# EAGLE schematic Dot (EAGLE 7.7.0)

## Sheet 1 of 3
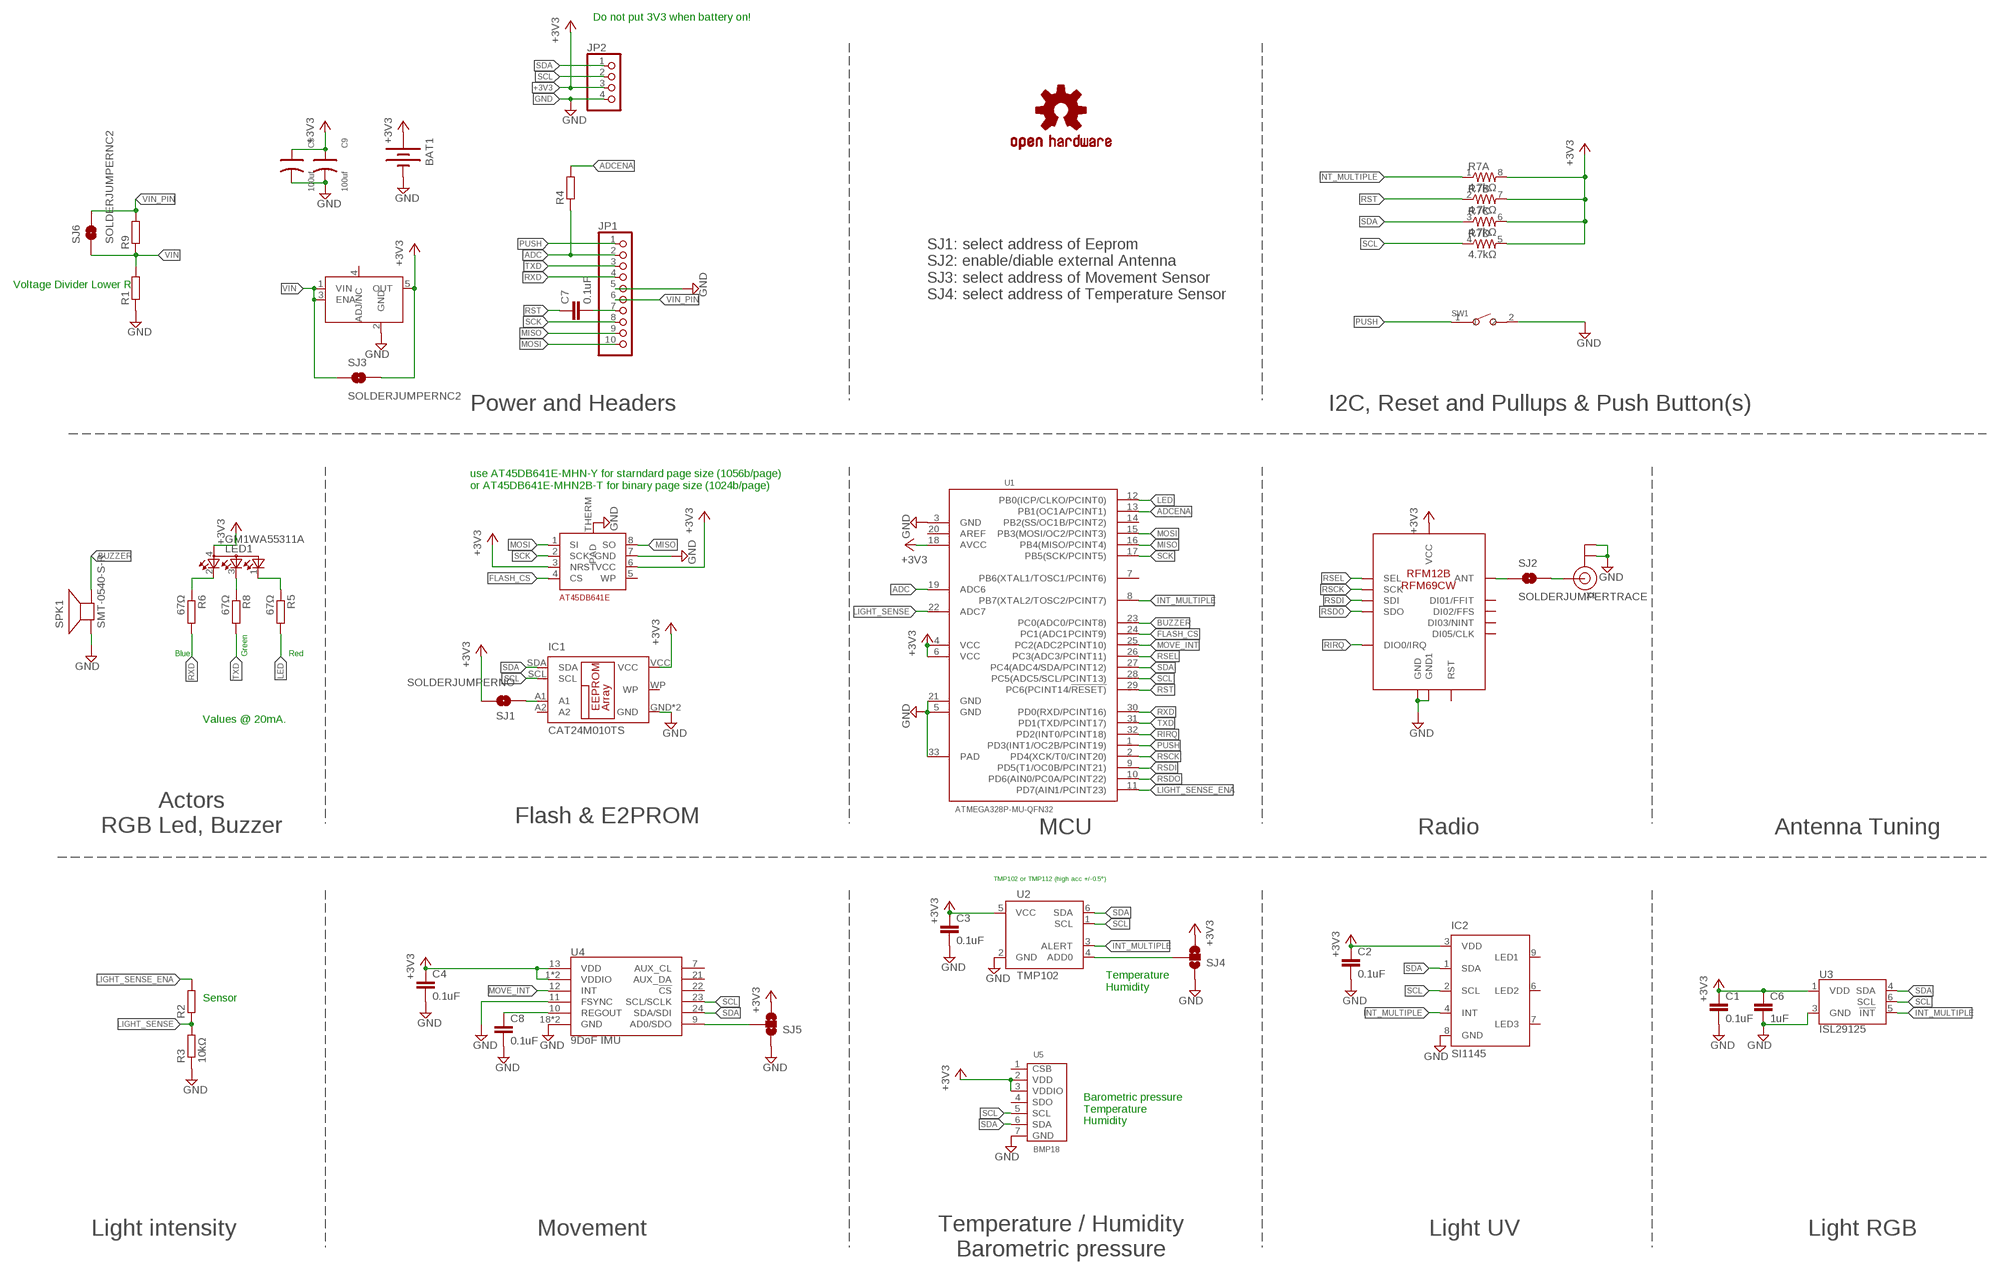
[diagram p0: schematic, sheet 1]

### Parts
BAT1  BATTERY20PTH  [BATTCOM_20MM_PTH]
C1  0.1uF  C-EUC0603  [C0603]
C2  0.1uF  C-EUC0603  [C0603]
C3  0.1uF  C-EUC0603  [C0603]
C4  0.1uF  C-EUC0603  [C0603]
C5  100uf  TANTALUM-SMD-100UF-6.3V(AVX-A)  [AVX-A]
C6  1uF  C-EUC0603  [C0603]
C7  0.1uF  C-EUC0603  [C0603]
C8  0.1uF  C-EUC0603  [C0603]
C9  100uf  TANTALUM-SMD-100UF-6.3V(AVX-A)  [AVX-A]
IC1  CAT24M010TS  [TSSOP8]
IC2  SI1145  [QFN-10]
JP1  PINHD-1X10  [1X10]
JP2  PINHD-1X4  [1X04]
LED1  GM1WA55311A  [GM1WA55311A]
LOGO1  OSHW-LOGOS  [OSHW-LOGO-S]
R1  R-EU_R0603  [R0603]
R2  R-EU_R0805  [R0805]
R3  10kΩ  R-EU_R0603  [R0603]
R4  R-EU_R0603  [R0603]
R5  67Ω  R-EU_R0603  [R0603]
R6  67Ω  R-EU_R0603  [R0603]
R7  4.7kΩ  RESISTOR-ARRAY0603-ARV  [0603-ARV]
R8  67Ω  R-EU_R0603  [R0603]
R9  R-EU_R0603  [R0603]
SJ1  SOLDERJUMPERNO  [SJ_2S-NO]
SJ2  SOLDERJUMPERTRACE  [SJ_2S-TRACE]
SJ3  SOLDERJUMPERNC2  [SJ_2S-NOTRACE]
SJ4  SOLDERJUMPER_2WAYS  [SJ_3]
SJ5  SOLDERJUMPER_2WAYS  [SJ_3]
SJ6  SOLDERJUMPERNC2  [SJ_2S-NOTRACE]
SPK1  SMT-0540-S-R  [SMT-0540-S-R]
SW1  SMD-BUTTON(2P-6.0X3.0X2.5MM)-DHT-1163S  [SW2-4.0-6.0X3.0X2.5MM]
U1  ATMEGA328P-MU-QFN32  MCU-ATMEGA328P-MU(QFN32)  [QFN32G-0.5-5X5MM]
U2  TMP102  [SOT563]
U3  ISL29125  [ODFN-6]
U4  9DoF IMU  MPU-9250  [QFN24-3X3]
U5  BMP18  PRESSURE-BMP180(LGA7)  [LGA7-1.5-3.8X3.6MM]
U$1  RFM12B/69CW  [RFM12B/69CW]
U$3  AT45DB641E  [UDFN-8]
U$4  LDCL015  [SOT23-5]
X1  ANTENNA_U.FL  [U.FL]

### Nets
+3V3: BAT1.1(+) C1.1 C2.1 C3.1 C4.1 C5.+ C6.1 C9.+ IC1.VCC IC2.3(VDD) JP2.3 LED1.4(A) R7.5 R7.6 R7.7 R7.8 SJ1.2 SJ3.2 SJ4.3 SJ5.3 U1.4(VCC) U1.6(VCC) U1.18(AVCC) U2.5(VCC) U3.1(VDD) U4.1(VDDIO) U4.8(VDDIO) U4.13(VDD) U5.2(VDD) U5.3(VDDIO) U$1.VDD(VCC) U$3.3(NRST) U$3.6(VCC) U$4.5(OUT)
ADC: JP1.2 R4.1 U1.19(ADC6)
ADCENA: R4.2 U1.13(PB1(OC1A/PCINT1))
BUZZER: SPK1.+(-) U1.23(PC0(ADC0/PCINT8))
FLASH_CS: U1.24(PC1(ADC1PCINT9)) U$3.4(CS)
GND: BAT1.2(-) C1.2 C2.2 C3.2 C4.2 C5.- C6.2 C8.2 C9.- IC1.GND IC1.NC(GND) IC2.8(GND) JP1.5 JP2.4 R1.1 R3.1 SJ4.1 SJ5.1 SPK1.-(+) SW1.2 U1.3(GND) U1.5(GND) U1.21(GND) U1.33(PAD) U2.2(GND) U3.3(GND) U4.11(FSYNC) U4.18(GND) U4.20(GND) U5.7(GND) U$1.GND U$1.GND1 U$3.7(GND) U$3.THERM(PAD) U$4.2(GND) X1.1(GND) X1.2(GND)
INT_MULTIPLE: IC2.4(INT) R7.1 U1.8(PB7(XTAL2/TOSC2/PCINT7)) U2.3(ALERT) U3.5(!INT)
LED: R5.2 U1.12(PB0(ICP/CLKO/PCINT0))
LIGHT_SENSE: R2.1 R3.2 U1.22(ADC7)
LIGHT_SENSE_ENA: R2.2 U1.11(PD7(AIN1/PCINT23))
MISO: JP1.9 U1.16(PB4(MISO/PCINT4)) U$3.8(SO)
MOSI: JP1.10 U1.15(PB3(MOSI/OC2/PCINT3)) U$3.1(SI)
MOVE_INT: U1.25(PC2(ADC2PCINT10)) U4.12(INT)
N$1: LED1.3(CBLUE) R8.1
N$2: IC1.A1 SJ1.1
N$3: SJ2.1 U$1.ANT
N$4: LED1.2(CRED) R6.1
N$5: C7.2 JP1.7
N$7: SJ2.2 X1.3(SIGNAL)
N$10: SJ4.2 U2.4(ADD0)
N$11: C8.1 U4.10(REGOUT)
N$14: SJ5.2 U4.9(AD0/SDO)
N$15: LED1.1(CGREEN) R5.1
PUSH: JP1.1 SW1.1 U1.1(PD3(INT1/OC2B/PCINT19))
RIRQ: U1.32(PD2(INT0/PCINT18)) U$1.IRQ(DIO0/IRQ)
RSCK: U1.2(PD4(XCK/T0/CINT20)) U$1.SCK
RSDI: U1.9(PD5(T1/OC0B/PCINT21)) U$1.SDI
RSDO: U1.10(PD6(AIN0/PC0A/PCINT22)) U$1.SDO
RSEL: U1.26(PC3(ADC3/PCINT11)) U$1.SEL
RST: C7.1 R7.2 U1.29(PC6(PCINT14/!RESET))
RXD: JP1.4 R6.2 U1.30(PD0(RXD/PCINT16))
SCK: JP1.8 U1.17(PB5(SCK/PCINT5)) U$3.2(SCK)
SCL: IC1.SCL IC2.2(SCL) JP2.2 R7.4 U1.28(PC5(ADC5/SCL/PCINT13)) U2.1(SCL) U3.6(SCL) U4.23(SCL/SCLK) U5.5(SCL)
SDA: IC1.SDA IC2.1(SDA) JP2.1 R7.3 U1.27(PC4(ADC4/SDA/PCINT12)) U2.6(SDA) U3.4(SDA) U4.24(SDA/SDI) U5.6(SDA)
TXD: JP1.3 R8.2 U1.31(PD1(TXD/PCINT17))
VIN: R1.2 R9.1 SJ3.1 SJ6.1 U$4.1(VIN) U$4.3(ENA)
VIN_PIN: JP1.6 R9.2 SJ6.2
Unconnected: IC1.A2 IC1.WP IC2.6(LED2) IC2.7(LED3) IC2.9(LED1) U1.7(PB6(XTAL1/TOSC1/PCINT6)) U1.14(PB2(SS/OC1B/PCINT2)) U1.20(AREF) U4.7(AUX_CL) U4.21(AUX_DA) U4.22(!CS) U5.1(CSB) U5.4(SDO) U$1.CLK(DI05/CLK) U$1.FFIT(DI01/FFIT) U$1.FFS(DI02/FFS) U$1.NINT(DI03/NINT) U$1.RST U$3.5(WP) U$4.4(ADJ/NC)

### Notes on the sheet
- Do not put 3V3 when battery on!
- Voltage Divider Lower R
- SJ1: select address of Eeprom
  SJ2: enable/diable external Antenna
  SJ3: select address of Movement Sensor
  SJ4: select address of Temperature Sensor
- Power and Headers | I2C, Reset and Pullups & Push Button(s)
- use AT45DB641E-MHN-Y for starndard page size (1056b/page)
  or AT45DB641E-MHN2B-T for binary page size (1024b/page)
- Blue | Green | Red
- Values @ 20mA.
- Actors
  RGB Led, Buzzer
- Flash & E2PROM
- MCU | Radio | Antenna Tuning
- TMP102 or TMP112 (high acc +/-0.5°)
- Temperature
  Humidity
- Sensor
- Barometric pressure
  Temperature
  Humidity
- Light intensity | Movement
- Temperature / Humidity
  Barometric pressure
- Light UV | Light RGB

## Sheet 2 of 3
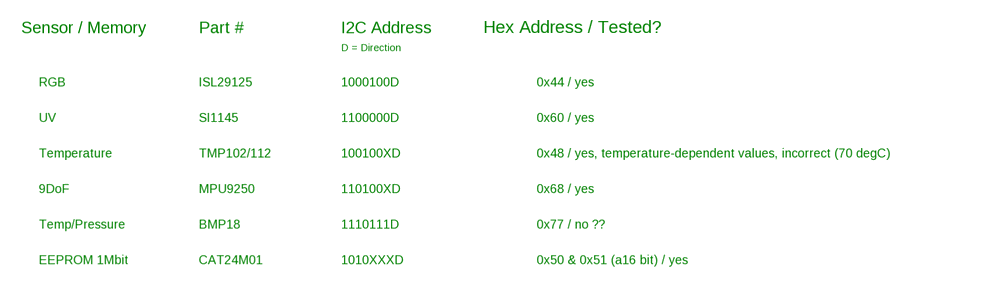
[diagram p1: schematic, sheet 2]

### Notes on the sheet
- Sensor / Memory | Part # | I2C Address | Hex Address / Tested?
- D = Direction
- RGB | ISL29125 | 1000100D | 0x44 / yes
- UV | SI1145 | 1100000D | 0x60 / yes
- Temperature | TMP102/112 | 100100XD | 0x48 / yes, temperature-dependent values, incorrect (70 degC)
- 9DoF | MPU9250 | 110100XD | 0x68 / yes
- Temp/Pressure | BMP18 | 1110111D | 0x77 / no ??
- EEPROM 1Mbit | CAT24M01 | 1010XXXD | 0x50 & 0x51 (a16 bit) / yes

## Sheet 3 of 3
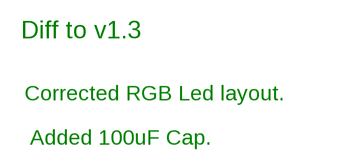
[diagram p2: schematic, sheet 3]

### Notes on the sheet
- Diff to v1.3
- Corrected RGB Led layout.
- Added 100uF Cap.

## Library data of the parts
BAT1 = Battery:BATTERY: Battery Holders Various common sizes : AA, AAA, 20mm coin cell and 12mm coin cell.
C1-C4 C6-C8 = resistor:C-EU: CAPACITOR, European symbol
C5 C9 = Seeed-OPL-Capacitor:TANTALUM-SMD-100UF-6.3V(AVX-A): 302020003; MPN: TLJA107M006R0800
IC1 = CAT24M01YI:CAT24M01: Serial EEPROM 1Mb, I2C; MF: On Semiconductor; MPN: 24C00T-E/ST
IC2 = silabs:SI114*: PROXIMITY/UV/AMBIENT LIGHT SENSOR IC WITH I2C INTERFACE Source: http://www.silabs.com/Support%20Documents/TechnicalDocs/Si1145-46-47.pdf
JP1 = pinhead:PINHD-1X10: PIN HEADER
JP2 = pinhead:PINHD-1X4: PIN HEADER
LED1 = led:GM1WA55311A: Chip LED RGB Source: http://document.sharpsma.com/files/GM1WA55311A_SS.pdf
LOGO1 = Particle-Devices:OSHW-LOGO: Open Source Hardware Logo This logo indicates the piece of hardware it is found on incorporates a OSHW license and/or adheres to the definition of open source hardware found here: http://freedomdefined.org/OSHW
R1-R6 R8 R9 = resistor:R-EU_: RESISTOR, European symbol
R7 = SparkFun:RESISTOR-ARRAY: Array Chip Resistor Source: RS Component / Phycomp
SJ1-SJ3 SJ6 = SparkFun:SOLDERJUMPER: Solder Jumper Standard SMD solder jumper. Used to automate production. Two varients : Normally Open and Normally Closed are the same, but have different paste layers. NC will have a large amount of paste and should jumper during reflow.
SJ4 SJ5 = SparkFun:SOLDERJUMPER_2WAY: Solder Jumper 2 way solder jumper
SPK1 = adafruit:SMT-0540-S-R: SMT-0549-S-R Small surface-mount magnetic buzzer
SW1 = Seeed-OPL-Switch:SMD-BUTTON(2P-6.0X3.0X2.5MM): 311020029
U1 = Seeed-OPL-ic:MCU-ATMEGA328P-MU(QFN32): 310010005; MPN: ATMEGA328P-MU
U2 = SparkFun:TMP102
U3 = SparkFun-Sensors:ISL29125: Intersil ISL29125 RGB Color Light Sensor The ISL29125 is a low power, high sensitivity, RED, GREEN and BLUE color light sensor (RGB) with an I2C (SMBus compatible) interface. Its state-of-the-art photodiode array provides an accurate RGB spectral response and excellent light source to light source variation (LS2LS). Datasheet <https://cdn.sparkfun.com/datasheets/Sensors/LightImaging/isl29125.pdf> SparkFun Products SparkFun RGB Light Sensor - ISL29125 <https://www.sparkfun.com/products/12829> (SEN-12829); PROD_ID: IC-12055
U4 = SparkFun-Sensors:MPU-9250: MPU-9250 9 Degree of Freedom IMU System in Package that contains MPU-6500 & AK8963 NC pin 19. 2-6 & 14-17 not internally connected. May be used for PCB trace routing. Datasheet <https://cdn.sparkfun.com/assets/learn_tutorials/5/5/0/MPU9250REV1.0.pdf> SparkFun Products: SparkFun 9DoF Razor IMU M0 <https://www.sparkfun.com/products/14001> SparkFun IMU Breakout - MPU-9250 <https://www.sparkfun.com/products/13762>; PROD_ID: IC-13192
U5 = Seeed-OPL-sensor:PRESSURE-BMP180(LGA7): 314030004; MPN: BMP18
U$1 = rfm12b_withoutPlanes:RFM12B/69CW
U$3 = AT45DB641E:AT45DB641E
U$4 = LDCL015:LDCL015
X1 = adafruit:ANTENNA_U.FL: U.FL Antenna Connector